# EAGLE schematic Temp_Ctrlr_Schematic_final (EAGLE 9.7.0)
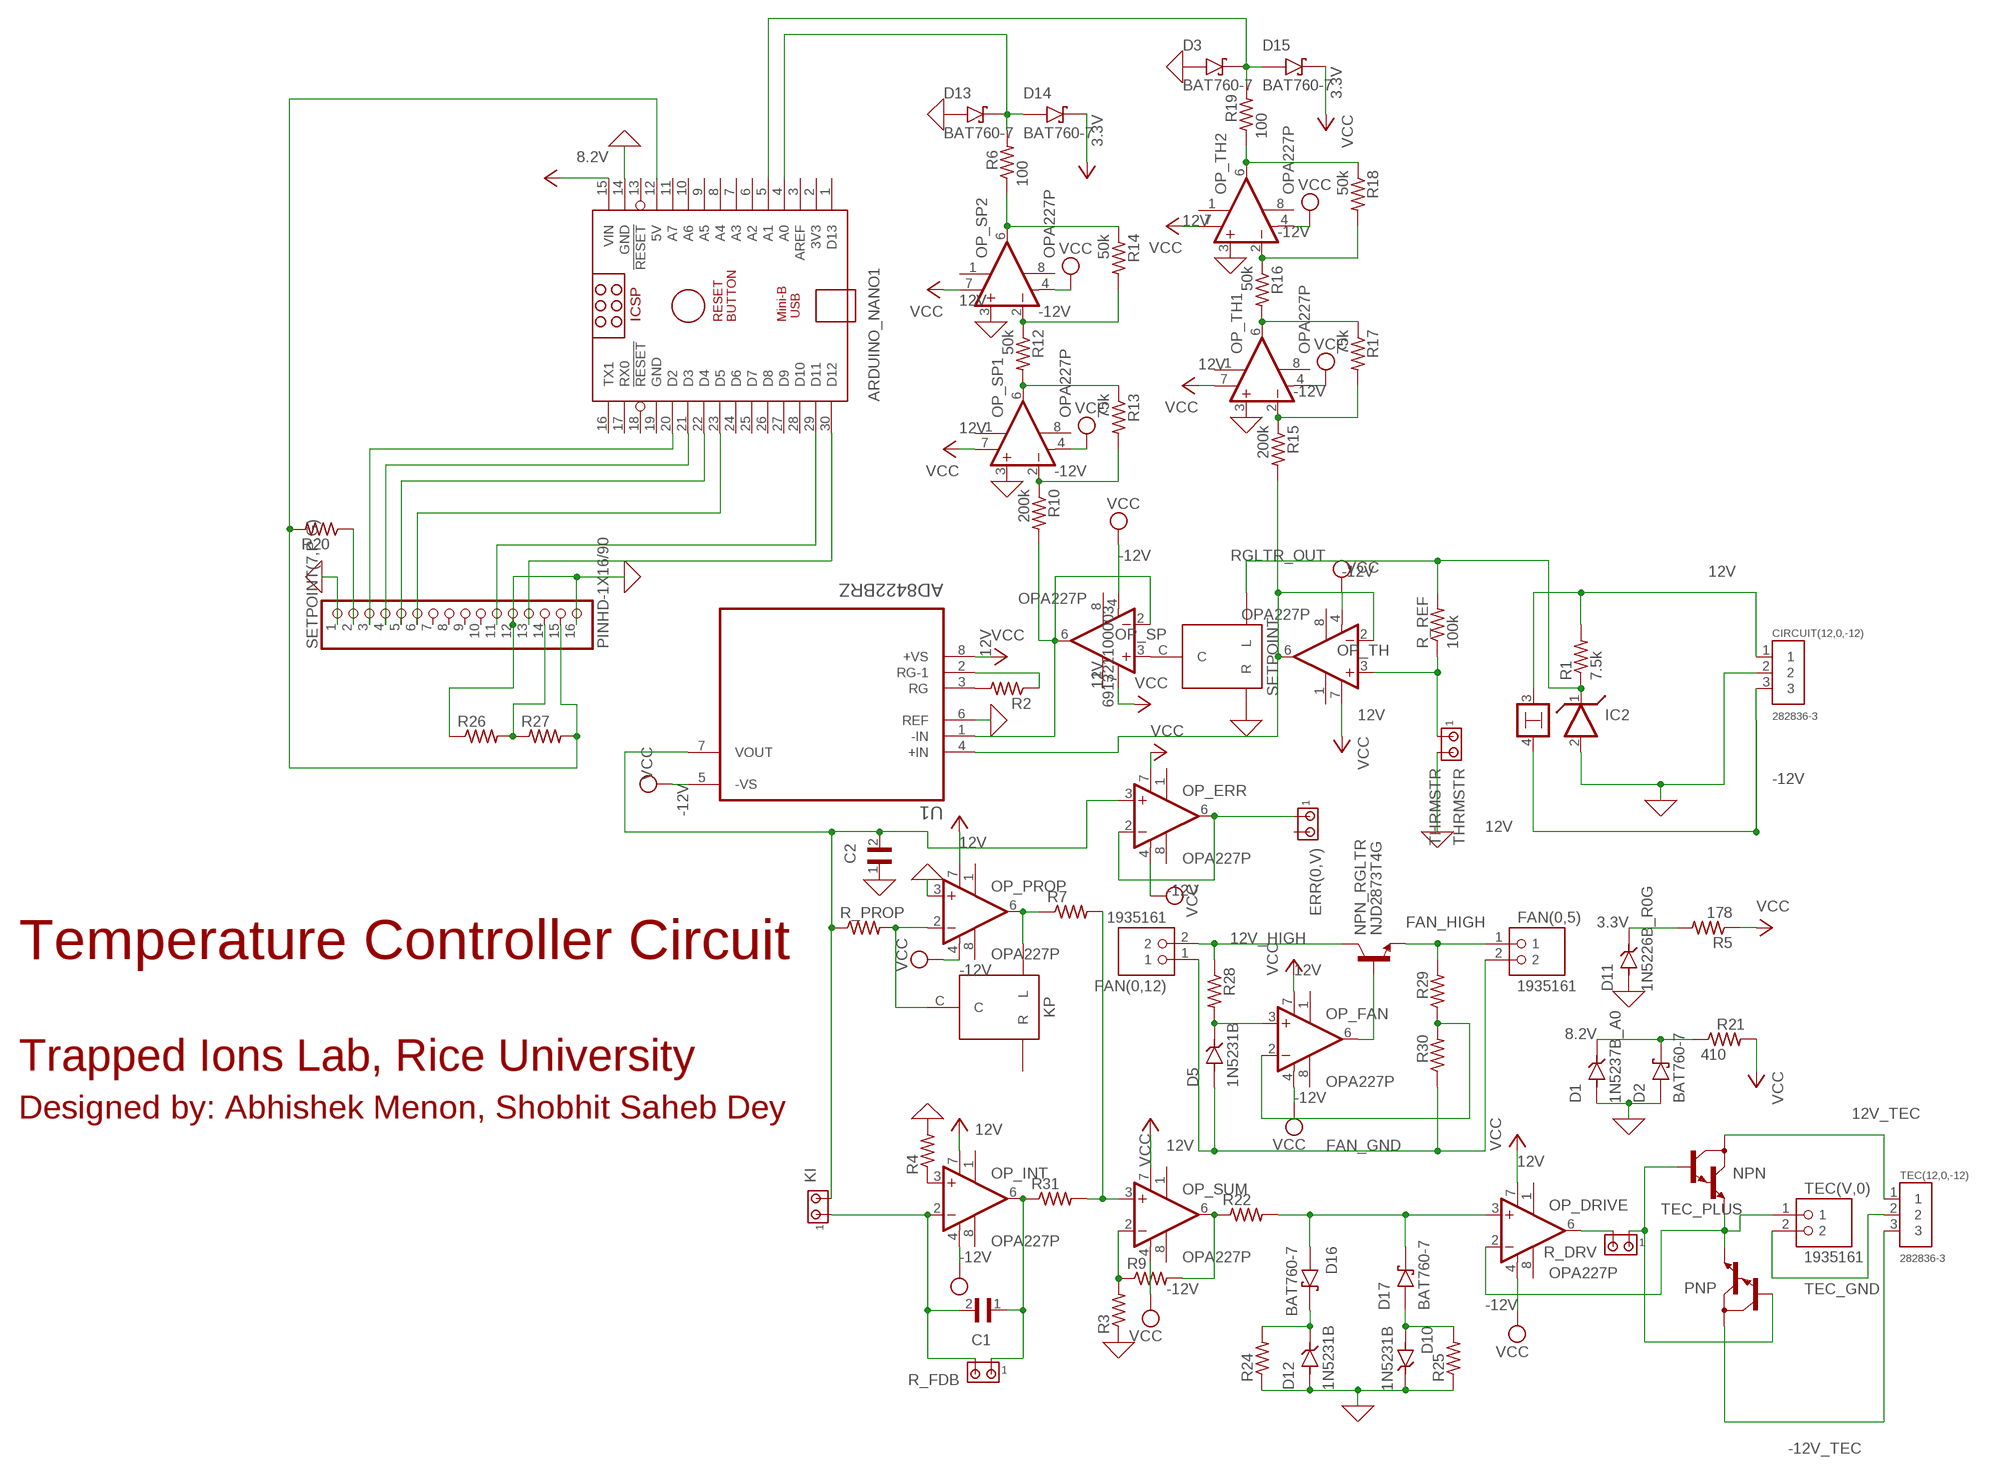
[diagram p0: schematic, sheet 1]

## Parts
ARDUINO_NANO1  ARDUINO_NANO  [ARDUINO_NANO]
C1  C315C470J1G5TA  [CAPRR254W54L381T254H466]
C2  C315C470J1G5TA  [CAPRR254W54L381T254H466]
CIRCUIT(12,0,-12)  282836-3  [TE_282836-3]
D1  1N5237B_A0  [DIOAD928W47L399D179]
D2  BAT760-7  [SOD2513X120N]
D3  BAT760-7  [SOD2513X120N]
D5  1N5231B  [DIOAD928W47L399D179]
D10  1N5231B  [DIOAD928W47L399D179]
D11  1N5226B_R0G  [DIOAD928W47L399D179]
D12  1N5231B  [DIOAD928W47L399D179]
D13  BAT760-7  [SOD2513X120N]
D14  BAT760-7  [SOD2513X120N]
D15  BAT760-7  [SOD2513X120N]
D16  BAT760-7  [SOD2513X120N]
D17  BAT760-7  [SOD2513X120N]
ERR(0,V)  MTA02-156  [1X2MTA]
FAN(0,5)  1935161  [PHOENIX_1935161]
FAN(0,12)  1935161  [PHOENIX_1935161]
IC2  LM399H  [TO39/4]
KI  MTA02-156  [1X2MTA]
KP  691321100003  [691322110003]
NPN  MJD122  [DPAK]
NPN_RGLTR  NJD2873T4G  [TO229P990X238-3N]
OP_DRIVE  OPA227P  [DIL08]
OP_ERR  OPA227P  [DIL08]
OP_FAN  OPA227P  [DIL08]
OP_INT  OPA227P  [DIL08]
OP_PROP  OPA227P  [DIL08]
OP_SP  OPA227P  [DIL08]
OP_SP1  OPA227P  [DIL08]
OP_SP2  OPA227P  [DIL08]
OP_SUM  OPA227P  [DIL08]
OP_TH  OPA227P  [DIL08]
OP_TH1  OPA227P  [DIL08]
OP_TH2  OPA227P  [DIL08]
PNP  MJD122  [DPAK]
R1  7.5k  R-US_0411/3V  [0411V]
R2  R-US_0411/3V  [0411V]
R3  R-US_0411/3V  [0411V]
R4  R-US_0411/3V  [0411V]
R5  178  R-US_0411/3V  [0411V]
R6  100  R-US_0411/3V  [0411V]
R7  R-US_0411/3V  [0411V]
R9  R-US_0411/3V  [0411V]
R10  200k  R-US_0411/3V  [0411V]
R12  50k  R-US_0411/3V  [0411V]
R13  75k  R-US_0411/3V  [0411V]
R14  50k  R-US_0411/3V  [0411V]
R15  200k  R-US_0411/3V  [0411V]
R16  50k  R-US_0411/3V  [0411V]
R17  75k  R-US_0411/3V  [0411V]
R18  50k  R-US_0411/3V  [0411V]
R19  100  R-US_0411/3V  [0411V]
R20  R-US_0411/3V  [0411V]
R21  410  R-US_0411/3V  [0411V]
R22  R-US_0411/3V  [0411V]
R24  R-US_0411/3V  [0411V]
R25  R-US_0411/3V  [0411V]
R26  R-US_0411/3V  [0411V]
R27  R-US_0411/3V  [0411V]
R28  R-US_0411/3V  [0411V]
R29  R-US_0411/3V  [0411V]
R30  R-US_0411/3V  [0411V]
R31  R-US_0411/3V  [0411V]
R_DRV  MTA02-156  [1X2MTA]
R_FDB  MTA02-156  [1X2MTA]
R_PROP  R-US_0411/3V  [0411V]
R_REF  100k  R-US_0411/3V  [0411V]
SETPOINT  691321100003  [691322110003]
SETPOINT(7,P,G)  PINHD-1X16/90  [1X16/90]
TEC(12,0,-12)  282836-3  [TE_282836-3]
TEC(V,0)  1935161  [PHOENIX_1935161]
THRMSTR  THRMSTR  MTA02-156  [1X2MTA]
U1  AD8422BRZ  [SOIC127P600X175-8N]

## Nets
0: ARDUINO_NANO1.14(GND) C2.1 CIRCUIT(12,0,-12).2 D1.A D2.A D3.A D10.C(K) D11.A D12.A D13.A IC2.2 OP_PROP.3(+IN) OP_SP1.3(+IN) OP_SP2.3(+IN) OP_TH1.3(+IN) OP_TH2.3(+IN) R3.1 R4.2 R24.1 R25.1 R26.1 SETPOINT(7,P,G).1 SETPOINT(7,P,G).12 SETPOINT(7,P,G).16 SETPOINT.R THRMSTR.2 U1.6(REF) ; supply symbol labelled GND
3.3V: D11.C(K) D14.C(K) D15.C(K) R5.2 ; supply symbol labelled VCC
8.2V: ARDUINO_NANO1.15(VIN) D1.C(K) D2.C(K) R21.1 ; supply symbol labelled VCC
12V: CIRCUIT(12,0,-12).1 IC2.3 OP_DRIVE.7(V+) OP_ERR.7(V+) OP_FAN.7(V+) OP_INT.7(V+) OP_PROP.7(V+) OP_SP1.7(V+) OP_SP2.7(V+) OP_SP.7(V+) OP_SUM.7(V+) OP_TH1.7(V+) OP_TH2.7(V+) OP_TH.7(V+) R1.2 R5.1 U1.8(+VS) ; supply symbol labelled VCC
12V_HIGH [Fan]: FAN(0,12).2 NPN_RGLTR.4(C) R28.1
12V_TEC [TEC_driving]: NPN.4(C) TEC(12,0,-12).1
-12V: CIRCUIT(12,0,-12).3 IC2.4 OP_DRIVE.4(V-) OP_ERR.4(V-) OP_FAN.4(V-) OP_INT.4(V-) OP_PROP.4(V-) OP_SP1.4(V-) OP_SP2.4(V-) OP_SP.4(V-) OP_SUM.4(V-) OP_TH1.4(V-) OP_TH2.4(V-) OP_TH.4(V-) U1.5(-VS) ; supply symbol labelled VCC
-12V_TEC [TEC_driving]: PNP.4(C) TEC(12,0,-12).3
AD1 [INA]: OP_SP.2(-IN) OP_SP.6(OUT) R10.2 U1.1(-IN)
AD4 [INA]: OP_TH.2(-IN) OP_TH.6(OUT) R15.2 U1.4(+IN)
AD7 [INA]: C2.2 KI.2 OP_ERR.3(+IN) R_PROP.1 U1.7(VOUT)
FAN_GND [Fan]: D5.A FAN(0,5).2 FAN(0,12).1 R30.1
FAN_HIGH [Fan]: FAN(0,5).1 NPN_RGLTR.3(E) R29.2
N$1: OP_INT.3(+IN) R4.1
N$2: OP_TH.3(+IN) R_REF.1 THRMSTR.1
N$3: OP_SUM.6(OUT) R9.2 R22.1
N$4: OP_SP.3(+IN) SETPOINT.C
N$5: R2.2 U1.3(RG)
N$7: KP.L OP_PROP.6(OUT) R7.1
N$8: R2.1 U1.2(RG-1)
N$9: C1.2 KI.1 OP_INT.2(-IN) R_FDB.2
N$10: OP_SUM.3(+IN) R7.2 R31.2
N$11: OP_DRIVE.6(OUT) R_DRV.2
N$12: NPN.1(B) PNP.1(B) R_DRV.1
N$13: OP_SP1.2(-IN) R10.1 R13.2
N$14: OP_SP1.6(OUT) R12.2 R13.1
N$16: OP_SUM.2(-IN) R3.2 R9.1
N$18: OP_SP2.2(-IN) R12.1 R14.2
N$19: OP_SP2.6(OUT) R6.1 R14.1
N$20: OP_TH1.2(-IN) R15.1 R17.2
N$21: OP_TH1.6(OUT) R16.2 R17.1
N$22: OP_TH2.2(-IN) R16.1 R18.2
N$23: OP_TH2.6(OUT) R18.1 R19.1
N$24: ARDUINO_NANO1.4(A0) D13.C(K) D14.A R6.2
N$25: ARDUINO_NANO1.5(A1) D3.C(K) D15.A R19.2
N$26: ERR(0,V).1 OP_ERR.2(-IN) OP_ERR.6(OUT)
N$27: ARDUINO_NANO1.29(D11) SETPOINT(7,P,G).11
N$28: ARDUINO_NANO1.20(D2) SETPOINT(7,P,G).3
N$29: ARDUINO_NANO1.21(D3) SETPOINT(7,P,G).4
N$30: ARDUINO_NANO1.22(D4) SETPOINT(7,P,G).5
N$31: ARDUINO_NANO1.23(D5) SETPOINT(7,P,G).6
N$32: R20.1 SETPOINT(7,P,G).2
N$33: R26.2 R27.1 SETPOINT(7,P,G).14
N$34: ARDUINO_NANO1.12(5V) R20.2 R27.2 SETPOINT(7,P,G).15
N$35: ARDUINO_NANO1.30(D12) SETPOINT(7,P,G).13
N$38: D16.A D17.C(K) OP_DRIVE.3(+IN) R22.2
N$39: D12.C(K) D16.C(K) R24.2
N$40: D10.A D17.A R25.2
N$41: C1.1 OP_INT.6(OUT) R31.1 R_FDB.1
N$42: KP.C OP_PROP.2(-IN) R_PROP.2
N$44: D5.C(K) OP_FAN.3(+IN) R28.2
N$45: OP_FAN.2(-IN) R29.1 R30.2
N$47: NPN_RGLTR.1(B) OP_FAN.6(OUT)
RGLTR_OUT: IC2.1 R1.1 R_REF.2 SETPOINT.L
TEC_GND [TEC_driving]: TEC(12,0,-12).2 TEC(V,0).2
TEC_PLUS [TEC_driving]: NPN.3(E) OP_DRIVE.2(-IN) PNP.3(E) TEC(V,0).1
VCC: R21.2
Unconnected: ARDUINO_NANO1.1(D13) ARDUINO_NANO1.2(3V3) ARDUINO_NANO1.3(AREF) ARDUINO_NANO1.6(A2) ARDUINO_NANO1.7(A3) ARDUINO_NANO1.8(A4) ARDUINO_NANO1.9(A5) ARDUINO_NANO1.10(A6) ARDUINO_NANO1.11(A7) ARDUINO_NANO1.13(!RESET) ARDUINO_NANO1.16(TX1) ARDUINO_NANO1.17(RX0) ARDUINO_NANO1.18(!RESET) ARDUINO_NANO1.24(D6) ARDUINO_NANO1.25(D7) ARDUINO_NANO1.26(D8) ARDUINO_NANO1.27(D9) ARDUINO_NANO1.28(D10) ERR(0,V).2 KP.R OP_DRIVE.1(OFF1) OP_DRIVE.8(OFF2) OP_ERR.1(OFF1) OP_ERR.8(OFF2) OP_FAN.1(OFF1) OP_FAN.8(OFF2) OP_INT.1(OFF1) OP_INT.8(OFF2) OP_PROP.1(OFF1) OP_PROP.8(OFF2) OP_SP1.1(OFF1) OP_SP1.8(OFF2) OP_SP2.1(OFF1) OP_SP2.8(OFF2) OP_SP.1(OFF1) OP_SP.8(OFF2) OP_SUM.1(OFF1) OP_SUM.8(OFF2) OP_TH1.1(OFF1) OP_TH1.8(OFF2) OP_TH2.1(OFF1) OP_TH2.8(OFF2) OP_TH.1(OFF1) OP_TH.8(OFF2) SETPOINT(7,P,G).7 SETPOINT(7,P,G).8 SETPOINT(7,P,G).9 SETPOINT(7,P,G).10

## Notes on the sheet
- Temperature Controller Circuit
- Trapped Ions Lab, Rice University
- Designed by: Abhishek Menon, Shobhit Saheb Dey

## Power pins joined to a net without a drawn wire
GND: ARDUINO_NANO1.19(GND)

## Library data of the parts
ARDUINO_NANO1 = ArduinoNanoV30:ARDUINO_NANO: Arduino Nano V3.0 Overview: The Arduino Nano is a small, complete, and breadboard-friendly board based on the ATmega328 (Arduino Nano 3.x) or ATmega168 (Arduino Nano 2.x). It has more or less the same functionality of the Arduino Duemilanove, but in a different package. It lacks only a DC power jack, and works with a Mini-B USB cable instead of a standard one. The Nano was designed and is being produced by Gravitech. Specifications: Microcontroller Atmel ATmega168 or ATmega328 Operating Voltage (logic level) 5 V Input Voltage (recommended) 7-12 V Input Voltage (limits) 6-20 V Digital I/O Pins 14 (of which 6 provide PWM output) Analog Input Pins 8 DC Current per I/O Pin 40 mA Flash Memory 16 KB (ATmega168) or 32 KB (ATmega328) of which 2 KB used by bootloader SRAM 1 KB (ATmega168) or 2 KB (ATmega328) EEPROM 512 bytes (ATmega168) or 1 KB (ATmega328) Clock Speed 16 MHz Dimensions 0.73" x 1.70" Length 45 mm Width 18 mm Weigth 5 g Power: The Arduino Nano can be powered via the Mini-B USB connection, 6-20V unregulated external power supply (pin 30), or 5V regulated external power supply (pin 27). The power source is automatically selected to the highest voltage source. Memory: The ATmega168 has 16 KB of flash memory for storing code (of which 2 KB is used for the bootloader); the ATmega328 has 32 KB, (also with 2 KB used for the bootloader). The ATmega168 has 1 KB of SRAM and 512 bytes of EEPROM (which can be read and written with the EEPROM library); the ATmega328 has 2 KB of SRAM and 1 KB of EEPROM. Input and Output: Each of the 14 digital pins on the Nano can be used as an input or output, using pinMode(), digitalWrite(), and digitalRead() functions. They operate at 5 volts. Each pin can provide or receive a maximum of 40 mA and has an internal pull-up resistor (disconnected by default) of 20-50 kOhms. In addition, some pins have specialized functions. Visit Arduino - ArduinoBoardNano <https://www.arduino.cc/en/Main/ArduinoBoardNano>
C1 C2 = C315C470J1G5TA:C315C470J1G5TA: Check availability <https://pricing.snapeda.com/parts/C315C470J1G5TA/KEMET/view-part?ref=eda>; AVAILABILITY: In Stock; CHECK_PRICES: https://www.snapeda.com/parts/C315C470J1G5TA/KEMET/view-part/?ref=eda; DESCRIPTION: Capacitor: ceramic; MLCC, monolithic; 47pF; 100V; C0G; ±5%; THT; MF: KEMET; MP: C315C470J1G5TA; PACKAGE: Radial Kemet; PRICE: None; PURCHASE-URL: https://www.snapeda.com/api/url_track_click_mouser/?unipart_id=1769422&manufacturer=KEMET&part_name=C315C470J1G5TA&search_term=through hole capacitor; SNAPEDA_LINK: https://www.snapeda.com/parts/C315C470J1G5TA/KEMET/view-part/?ref=snap
CIRCUIT(12,0,-12) TEC(12,0,-12) = 282836-3:282836-3: TERM BLOCK 3POS SIDE ENTRY 5MM Check availability <https://pricing.snapeda.com/parts/282836-3/TE%20Connectivity/view-part?ref=eda>; AVAILABILITY: In Stock; CHECK_PRICES: https://www.snapeda.com/parts/282836-3/TE+Connectivity+AMP+Connectors/view-part/?ref=eda; COMMENT: 282836-3; DESCRIPTION: Terminal Block Connector Wire Receptacle 3 5 mm 30-16 AWG Green 13.5 A 300 V | TE Connectivity 282836-3; EU_ROHS_COMPLIANCE: Compliant with Exemptions; MF: TE Connectivity; MP: 282836-3; PACKAGE: None; PRICE: None; PURCHASE-URL: https://www.snapeda.com/api/url_track_click_mouser/?unipart_id=134023&manufacturer=TE Connectivity&part_name=282836-3&search_term=282836-3; SNAPEDA_LINK: https://www.snapeda.com/parts/282836-3/TE+Connectivity+AMP+Connectors/view-part/?ref=snap
D1 = 1N5237B_A0:1N5237B_A0: Check availability <https://pricing.snapeda.com/parts/1N5237B%20A0/Taiwan%20Semiconductor/view-part?ref=eda>; AVAILABILITY: In Stock; CHECK_PRICES: https://www.snapeda.com/parts/1N5237B%20A0/Taiwan+Semiconductor/view-part/?ref=eda; DESCRIPTION: DO-35, 500mW, 5%, Small Signal Zener Diode; MF: Taiwan Semiconductor; MP: 1N5237B A0; PACKAGE: DO-35-2 Taiwan Semiconductor; PRICE: None; SNAPEDA_LINK: https://www.snapeda.com/parts/1N5237B%20A0/Taiwan+Semiconductor/view-part/?ref=snap
D2 D3 D13-D17 = BAT760-7:BAT760-7: Diode Schottky 30V 1A Surface Mount SOD-323 Check availability <https://pricing.snapeda.com/parts/BAT760-7/Diodes%20Inc./view-part?ref=eda>; AVAILABILITY: In Stock; CHECK_PRICES: https://www.snapeda.com/parts/BAT760-7/Diodes+Inc./view-part/?ref=eda; DESCRIPTION: Diode Schottky 30V 1A 2Pin SOD323 | Diodes Inc BAT760-7; MF: Diodes Inc.; MP: BAT760-7; PACKAGE: SOD-323 Diodes Inc.; PRICE: None; PURCHASE-URL: https://www.snapeda.com/api/url_track_click_mouser/?unipart_id=318039&manufacturer=Diodes Inc.&part_name=BAT760-7&search_term=sod-323; SNAPEDA_LINK: https://www.snapeda.com/parts/BAT760-7/Diodes+Inc./view-part/?ref=snap
D5 D10 D12 = 1N5231B:1N5231B: Check availability <https://pricing.snapeda.com/parts/1N5231B/Taiwan%20Semiconductor/view-part?ref=eda>; AVAILABILITY: In Stock; CHECK_PRICES: https://www.snapeda.com/parts/1N5231B/Taiwan+Semiconductor/view-part/?ref=eda; DESCRIPTION: Zener Diode Single 5.1V 5% 17Ohm 500mW 2-Pin DO-35 T/R; MF: Taiwan Semiconductor; MP: 1N5231B; PACKAGE: DO-35-2 Taiwan Semiconductor; PRICE: None; SNAPEDA_LINK: https://www.snapeda.com/parts/1N5231B/Taiwan+Semiconductor/view-part/?ref=snap
D11 = 1N5226B_R0G:1N5226B_R0G: Check availability <https://pricing.snapeda.com/parts/1N5226B%20R0G/Taiwan%20Semiconductor/view-part?ref=eda>; AVAILABILITY: In Stock; CHECK_PRICES: https://www.snapeda.com/parts/1N5226B%20R0G/Taiwan+Semiconductor/view-part/?ref=eda; DESCRIPTION: DO-35, 500mW, 5%, Small Signal Zener Diode; MF: Taiwan Semiconductor; MP: 1N5226B R0G; PACKAGE: DO-35-2 Taiwan Semiconductor; PRICE: None; SNAPEDA_LINK: https://www.snapeda.com/parts/1N5226B%20R0G/Taiwan+Semiconductor/view-part/?ref=snap
ERR(0,V) KI R_DRV R_FDB THRMSTR = con-amp:MTA02-156: AMP connector
FAN(0,5) FAN(0,12) TEC(V,0) = 1935161:1935161: Check availability <https://pricing.snapeda.com/parts/1935161/Phoenix%20Contact/view-part?ref=eda>; AVAILABILITY: In Stock; CHECK_PRICES: https://www.snapeda.com/parts/1935161/Phoenix+Contact/view-part/?ref=eda; DESCRIPTION: PCB Terminal Screw 5mm 16AWG 400V 17.5A 2 Position COMBICON PT Series | Phoenix Contact 1935161; MF: Phoenix Contact; MP: 1935161; PACKAGE: None; PRICE: None; PURCHASE-URL: https://www.snapeda.com/api/url_track_click_mouser/?unipart_id=423515&manufacturer=Phoenix Contact&part_name=1935161&search_term=1935161; SNAPEDA_LINK: https://www.snapeda.com/parts/1935161/Phoenix+Contact/view-part/?ref=snap
IC2 = LM399H:LM399H: Precision Z DIODE Check availability <https://pricing.snapeda.com/parts/LM399H/Analog%20Devices%20Inc./view-part?ref=eda>; AVAILABILITY: In Stock; CHECK_PRICES: https://www.snapeda.com/parts/LM399H/Analog+Devices/view-part/?ref=eda; DESCRIPTION: Shunt Voltage Reference IC Fixed 6.95V V ±0.17% 10 mA TO-46-4; MF: Analog Devices Inc.; MP: LM399H; PACKAGE: None; PRICE: None; PURCHASE-URL: https://www.snapeda.com/api/url_track_click_mouser/?unipart_id=9190342&manufacturer=Analog Devices Inc.&part_name=LM399H&search_term=lm399; SNAPEDA_LINK: https://www.snapeda.com/parts/LM399H/Analog+Devices/view-part/?ref=snap
KP SETPOINT = 691321100003:691321100003: Check availability <https://pricing.snapeda.com/parts/691321100003/Wurth%20Electronics/view-part?ref=eda>; AVAILABILITY: In Stock; CHECK_PRICES: https://www.snapeda.com/parts/691321100003/Wurth+Electronics+Inc./view-part/?ref=eda; DESCRIPTION: 3 Position Terminal Block Header, Male Pins, Shrouded (4 Side) 0.138 (3.50mm) Vertical - Through Hole; MF: Wurth Electronics; MP: 691321100003; PACKAGE: None; PRICE: None; PURCHASE-URL: https://www.snapeda.com/api/url_track_click_mouser/?unipart_id=1195106&manufacturer=Wurth Electronics&part_name=691321100003&search_term=term block 3pos 3.5mm; SNAPEDA_LINK: https://www.snapeda.com/parts/691321100003/Wurth+Electronics+Inc./view-part/?ref=snap
NPN PNP = MJD122:MJD122: TRANS DARL NPN 100V 5A DPAK Check availability <https://pricing.snapeda.com/parts/MJD122/ON%20Semiconductor/view-part?ref=eda>; AVAILABILITY: Not in stock; CHECK_PRICES: https://www.snapeda.com/parts/MJD122/Onsemi/view-part/?ref=eda; DESCRIPTION: Bipolar (BJT) Transistor NPN - Darlington 100V 8A 1.75W Surface Mount D-Pak; MF: ON Semiconductor; MP: MJD122; PACKAGE: DPAK-3 ON Semiconductor; PRICE: None; SNAPEDA_LINK: https://www.snapeda.com/parts/MJD122/Onsemi/view-part/?ref=snap
NPN_RGLTR = NJD2873T4G:NJD2873T4G: Check availability <https://pricing.snapeda.com/parts/NJD2873T4G/ON%20Semiconductor/view-part?ref=eda> Check availability <https://pricing.snapeda.com/parts/NJD2873T4G/ON%20Semiconductor/view-part?ref=eda>; AVAILABILITY: In Stock; CHECK_PRICES: https://www.snapeda.com/parts/NJD2873T4G/Onsemi/view-part/?ref=eda; DESCRIPTION: ON Semi NJD2873T4G NPN Bipolar Transistor, 2 A, 50 V, 3-Pin DPAK | ON Semiconductor NJD2873T4G; MF: ON Semiconductor; MP: NJD2873T4G; PACKAGE: DPAK-3 ON Semiconductor; PRICE: None; PURCHASE-URL: https://www.snapeda.com/api/url_track_click_mouser/?unipart_id=371921&manufacturer=ON Semiconductor&part_name=NJD2873T4G&search_term=njd2873t4g; SNAPEDA_LINK: https://www.snapeda.com/parts/NJD2873T4G/Onsemi/view-part/?ref=snap
OP_DRIVE OP_ERR OP_FAN OP_INT OP_PROP OP_SP OP_SP1 OP_SP2 OP_SUM OP_TH OP_TH1 OP_TH2 = linear:OPA22*: High Precision, Low Noise OPERATIONAL AMPLIFIERS Source: http://focus.ti.com/lit/ds/symlink/opa227.pdf
R1-R7 R9 R10 R12-R22 R24-R31 R_PROP R_REF = rcl:R-US_: RESISTOR, American symbol; SPICEPREFIX: R
SETPOINT(7,P,G) = Connector:PINHD-1X16: PIN HEADER; CATEGORY: Headers; DESCRIPTION: Header, Right Angle, 16 Position; MANUFACTURER: Generic; MPN: Generic; OPERATING_TEMPERATURE: Generic; PART_STATUS: Active; PITCH: 0.100" (2.54mm); ROHS_COMPLIANCE: Generic; SERIES: Generic; SUB-CATEGORY: Headers, Male Pins; TYPE: Board to Board or Cable, Unshrouded, Through Hole, Right Angle
U1 = AD8422BRZ:AD8422BRZ: None Check availability <https://pricing.snapeda.com/parts/AD8422BRZ/Analog%20Devices/view-part?ref=eda>; AVAILABILITY: In Stock; CHECK_PRICES: https://www.snapeda.com/parts/AD8422BRZ/Analog+Devices/view-part/?ref=eda; DESCRIPTION: High Performance, Low Power, Rail-to-Rail Precision Instrumentation Amplifier; MF: Analog Devices; MP: AD8422BRZ; PACKAGE: SOIC-8 Analog Devices; PRICE: None; SNAPEDA_LINK: https://www.snapeda.com/parts/AD8422BRZ/Analog+Devices/view-part/?ref=snap

## Net classes
0 default: width 0.254 mm, clearance 0.254 mm
1 opamp_driving: width 0.254 mm, clearance 0.254 mm
2 TEC_driving: width 1.27 mm, clearance 0.254 mm
3 INA: width 0.254 mm, clearance 0.254 mm
4 Fan: width 1.27 mm, clearance 0.254 mm